# Altium schematic sheet KEY.SchDoc
size A3; PageSetup: Record=PageOptions|CenterHorizontal=True|CenterVertical=True|PrintScale=1.00|XCorrection=1.00|YCorrection=1.00|PrintKind=1|BorderSize=5000000|LeftOffset=0|BottomOffset=0|Orientation=2|PaperLength=1000|PaperWidth=1000|Scale=100|PaperSource=7|PrintQuality=-3|MediaType=1|DitherType=10|PrintScaleMode=1|PaperKind=A3|PaperIndex=8
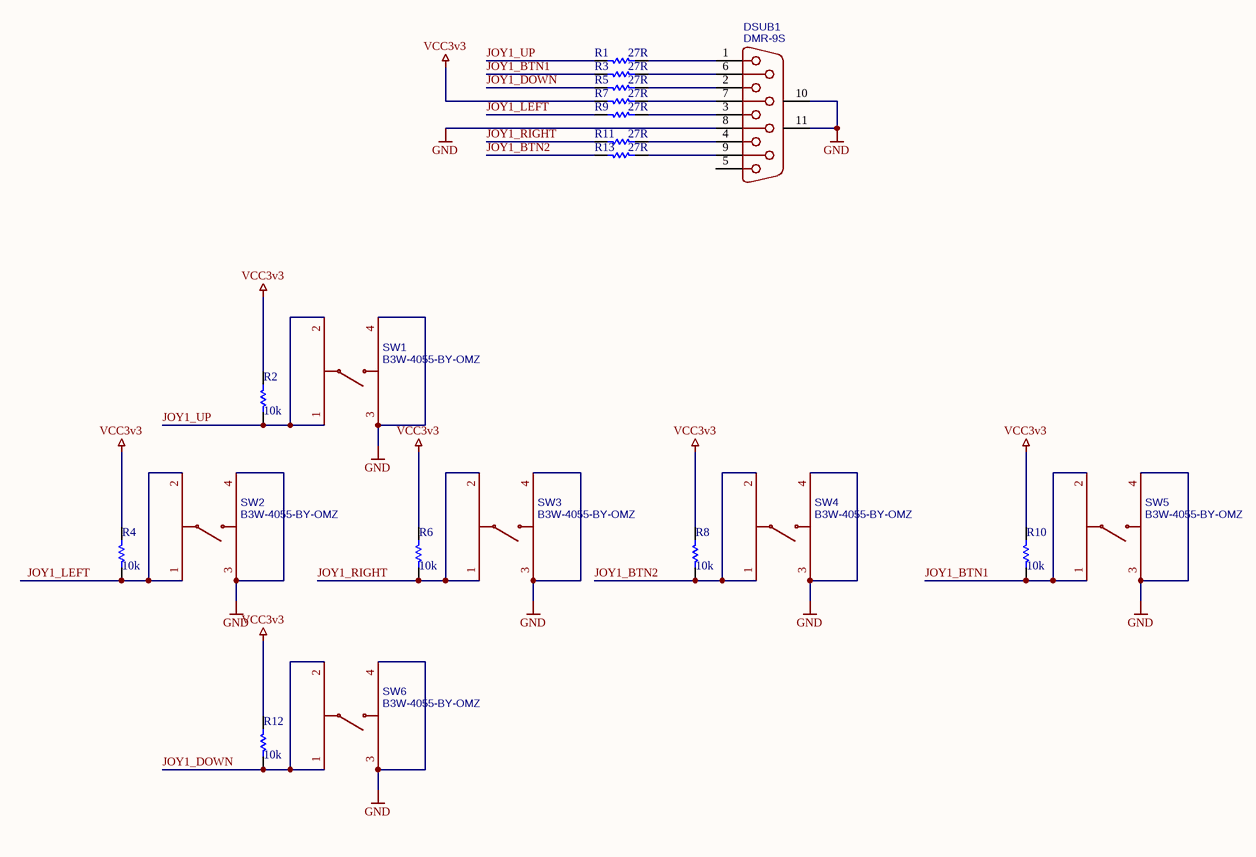
[diagram p0: KEY.SchDoc]

## Parts
DSUB1  DMR-9S  [DSUB-TH_DMR-9S]
R1  value 27R  [0603]  (hidden comment: 0603)
R2  value 10k  [0603]  (hidden comment: 0603)
R3  value 27R  [0603]  (hidden comment: 0603)
R4  value 10k  [0603]  (hidden comment: 0603)
R5  value 27R  [0603]  (hidden comment: 0603)
R6  value 10k  [0603]  (hidden comment: 0603)
R7  value 27R  [0603]  (hidden comment: 0603)
R8  value 10k  [0603]  (hidden comment: 0603)
R9  value 27R  [0603]  (hidden comment: 0603)
R10  value 10k  [0603]  (hidden comment: 0603)
R11  value 27R  [0603]  (hidden comment: 0603)
R12  value 10k  [0603]  (hidden comment: 0603)
R13  value 27R  [0603]  (hidden comment: 0603)
SW1  B3W-4055-BY-OMZ  [SW-TH_4P-L12.0-W12.0-P5.00-LS12.5-EH]
SW2  B3W-4055-BY-OMZ  [SW-TH_4P-L12.0-W12.0-P5.00-LS12.5-EH]
SW3  B3W-4055-BY-OMZ  [SW-TH_4P-L12.0-W12.0-P5.00-LS12.5-EH]
SW4  B3W-4055-BY-OMZ  [SW-TH_4P-L12.0-W12.0-P5.00-LS12.5-EH]
SW5  B3W-4055-BY-OMZ  [SW-TH_4P-L12.0-W12.0-P5.00-LS12.5-EH]
SW6  B3W-4055-BY-OMZ  [SW-TH_4P-L12.0-W12.0-P5.00-LS12.5-EH]

## Nets
GND: DSUB1.8 DSUB1.10(MH1) DSUB1.11(MH2) SW1.3 SW1.4 SW2.3 SW2.4 SW3.3 SW3.4 SW4.3 SW4.4 SW5.3 SW5.4 SW6.3 SW6.4
VCC3v3: R2.1 R4.1 R6.1 R7.2 R8.1 R10.1 R12.1
JOY1_BTN1: R3.2 R10.2 SW5.1 SW5.2
JOY1_BTN2: R8.2 R13.2 SW4.1 SW4.2
JOY1_DOWN: R5.2 R12.2 SW6.1 SW6.2
JOY1_LEFT: R4.2 R9.2 SW2.1 SW2.2
JOY1_RIGHT: R6.2 R11.2 SW3.1 SW3.2
JOY1_UP: R1.2 R2.2 SW1.1 SW1.2
NetDSUB1_1: DSUB1.1 R1.1
NetDSUB1_2: DSUB1.2 R5.1
NetDSUB1_3: DSUB1.3 R9.1
NetDSUB1_4: DSUB1.4 R11.1
NetDSUB1_6: DSUB1.6 R3.1
NetDSUB1_7: DSUB1.7 R7.1
NetDSUB1_9: DSUB1.9 R13.1

Not connected (* = marked no-connect by the designer): DSUB1 5

## Notes on the sheet
- Title
- Size:
- Date:
- A3
- Number:
- Time:
- Revision:
- Sheet
- of
- File:

## Library data of the parts
DSUB1 = DMR-9S: BOM_Manufacturer: Shenzhen Cankemeng; Contributor: LCSC; BOM_Supplier: LCSC; BOM_Supplier Part: C141882; BOM_Manufacturer Part: DMR-9S; BOM_JLCPCB Part Class: Extended Part; spicePre: D; spiceSymbolName: DMR-9S
R1-R13 = RES_0603: 0603 footprint resistor
SW1-SW6 = B3W-4055-BY-OMZ: BOM_Manufacturer: Omron Electronics; Contributor: LCSC; BOM_Supplier: LCSC; BOM_Supplier Part: C231334; BOM_Manufacturer Part: B3W-4055-BY-OMZ; BOM_JLCPCB Part Class: Extended Part; spicePre: S; spiceSymbolName: B3W-4055-BY-OMZ